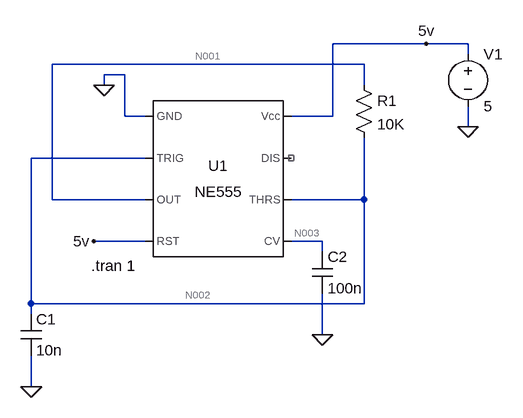
[diagram p0: schematic Draft1.asc]
Draft1.asc, the LTspice schematic file:
Version 4
SHEET 1 880 680
WIRE 480 -16 336 -16
WIRE 544 -16 480 -16
WIRE 544 0 544 -16
WIRE 384 16 -96 16
WIRE 16 32 -16 32
WIRE -16 48 -16 32
WIRE 384 48 384 16
WIRE 16 96 16 32
WIRE 48 96 16 96
WIRE 336 96 336 -16
WIRE 336 96 272 96
WIRE 544 112 544 80
WIRE 48 160 -128 160
WIRE -96 224 -96 16
WIRE 48 224 -96 224
WIRE 384 224 384 128
WIRE 384 224 272 224
WIRE 48 288 -32 288
WIRE 320 288 272 288
WIRE 320 304 320 288
WIRE -128 384 -128 160
WIRE 384 384 384 224
WIRE 384 384 -128 384
WIRE -128 400 -128 384
WIRE 320 432 320 368
WIRE -128 512 -128 464
FLAG -16 48 0
FLAG 544 112 0
FLAG 480 -16 5v
FLAG -32 288 5v
FLAG -128 512 0
FLAG 320 432 0
SYMBOL Misc\\NE555 160 192 R0
SYMATTR InstName U1
SYMBOL voltage 544 -16 R0
WINDOW 123 0 0 Left 0
WINDOW 39 0 0 Left 0
SYMATTR InstName V1
SYMATTR Value 5
SYMBOL cap -144 400 R0
SYMATTR InstName C1
SYMATTR Value 10n
SYMBOL cap 304 304 R0
SYMATTR InstName C2
SYMATTR Value 100n
SYMBOL res 368 32 R0
SYMATTR InstName R1
SYMATTR Value 10K
TEXT -36 326 Left 2 !.tran 1

The netlist it stands for:
* Draft1.asc
XU1 0 N002 N001 5v N003 N002 NC_01 5v NE555  ; pins GND TRIG OUT RST CV THRS DIS Vcc
V1 5v 0 5
C1 N002 0 10n
C2 N003 0 100n
R1 N001 N002 10K
.tran 1
.lib NE555.sub
.backanno
.end

* Results of the author's LTspice run, read from the files saved beside the schematic
* Operating Point, zero values left out:
*   V(n002) = 5 V
*   V(n003) = 3.333 V
*   V(5v) = 5 V
*   V(n001) = 5 V
*   I(R1) = 10 nA
*   I(V1) = -1.611 mA
*   Ix(u1:1) = -1.611 mA
*   Ix(u1:2) = 5 nA
*   Ix(u1:3) = -10 nA
*   Ix(u1:4) = 22.67 µA
*   Ix(u1:6) = 5 nA
*   Ix(u1:8) = 1.588 mA